# EAGLE design ftdi_breakout (EAGLE 6.4)
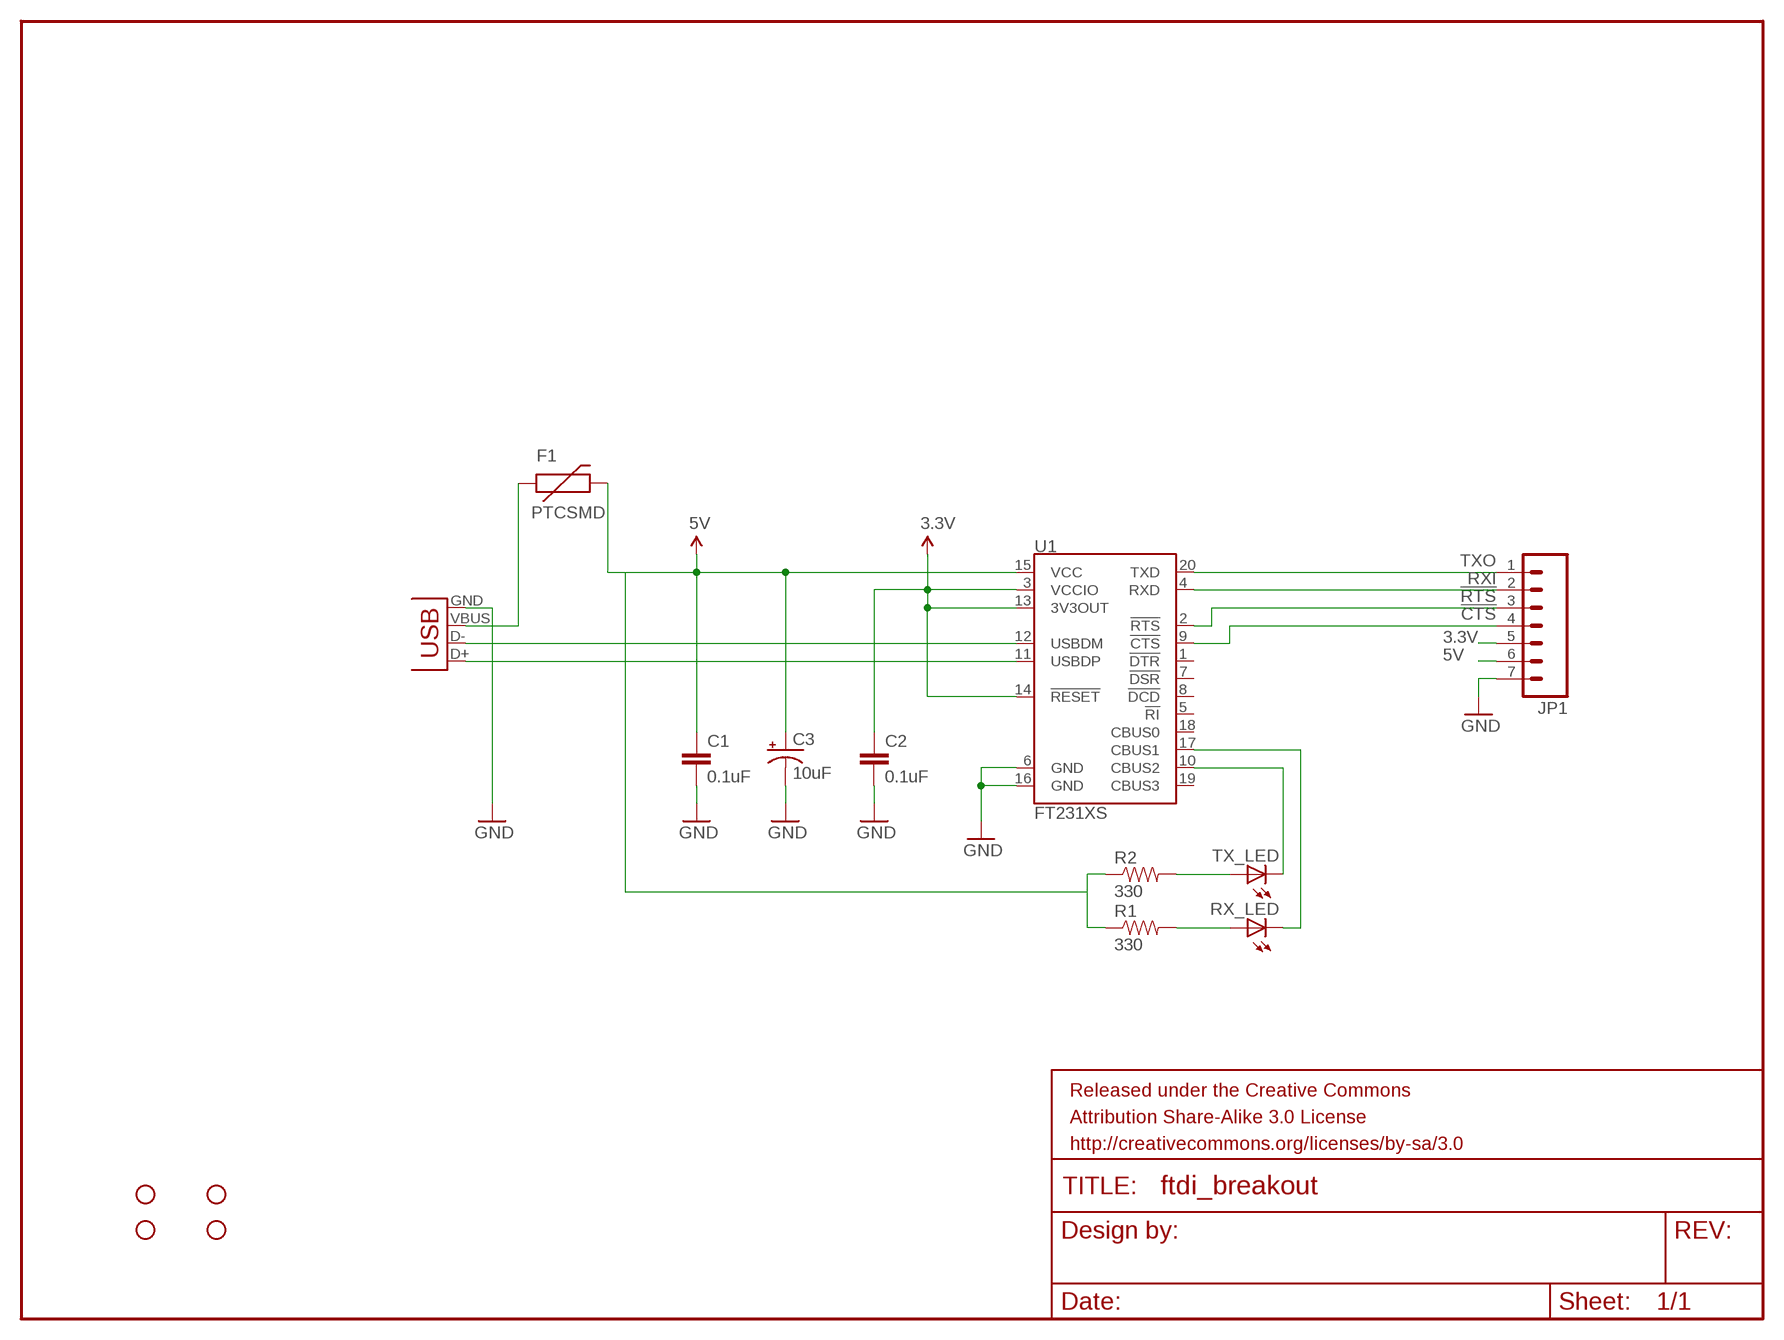
[diagram p0: schematic, sheet 1]

## Parts
C1  0.1uF  CAP0603-CAP  [0603-CAP]
C2  0.1uF  CAP0603-CAP  [0603-CAP]
C3  10uF  CAP_POL1206  [EIA3216]
F1  PTCSMD  [PTC-1206]
FRAME1  FRAME-LETTER  [CREATIVE_COMMONS]
JP1  M07  [1X07]
JP3  USBSMD  [USB-MINIB]
R1  330  RESISTOR0603-RES  [0603-RES]
R2  330  RESISTOR0603-RES  [0603-RES]
RX_LED  LED0603  [LED-0603]
STANDOFF1  STAND-OFF  [STAND-OFF]
STANDOFF2  STAND-OFF  [STAND-OFF]
STANDOFF3  STAND-OFF  [STAND-OFF]
STANDOFF4  STAND-OFF  [STAND-OFF]
TX_LED  LED0603  [LED-0603]
U1  FT231XS  [SSOP20_L]

## Nets
3.3V: C2.1 JP1.5 U1.3(VCCIO) U1.13(3V3OUT) U1.14(!RESET)
5V: C1.1 C3.A(+) F1.2 JP1.6 R1.1 R2.1 U1.15(VCC)
!CTS: JP1.4 U1.9(!CTS)
!RTS: JP1.3 U1.2(!RTS)
GND: C1.2 C2.2 C3.C(-) JP1.7 JP3.GND U1.6(GND) U1.16(GND)
N$1: JP3.D+ U1.11(USBDP)
N$2: F1.1 JP3.VBUS
N$3: JP3.D- U1.12(USBDM)
N$4: RX_LED.C U1.17(CBUS1)
N$5: TX_LED.C U1.10(CBUS2)
N$6: R2.2 TX_LED.A
N$7: R1.2 RX_LED.A
RXI: JP1.2 U1.4(RXD)
TXO: JP1.1 U1.20(TXD)
Unconnected: U1.1(!DTR) U1.5(!RI) U1.7(!DSR) U1.8(!DCD) U1.18(CBUS0) U1.19(CBUS3)

## Library data of the parts
C1 C2 = SparkFun-Passives:CAP: Capacitor Standard 0603 ceramic capacitor, and 0.1" leaded capacitor.
C3 = SparkFun-Passives:CAP_POL: Capacitor Polarized These are standard SMD and PTH capacitors. Normally 10uF, 47uF, and 100uF in electrolytic and tantalum varieties. Always verify the external diameter of the through hole cap, it varies with capacity, voltage, and manufacturer. The EIA devices should be standard.
F1 = SparkFun-PowerIC:PTC: Resettable Fuse PTC Resettable Fuse. Spark Fun Electronics SKU : COM-08357
FRAME1 = SparkFun-Aesthetics:FRAME-LETTER: Schematic Frame Standard 8.5x11 US Letter frame
JP1 = SparkFun-Connectors:M07: Header 7 Standard 7-pin 0.1" header. Use with straight break away headers (SKU : PRT-00116), right angle break away headers (PRT-00553), swiss pins (PRT-00743), machine pins (PRT-00117), and female headers (PRT-00115). NOTES ON THE VARIANTS LOCK and LOCK_LONGPADS... This footprint was designed to help hold the alignment of a through-hole component (i.e. 7-pin header) while soldering it into place. You may notice that each hole has been shifted either up or down by 0.005 of an inch from it's more standard position (which is usually a perfectly straight line). This slight alteration caused the pins (the squares in the middle) to touch the edges of the holes. Because they are alternating, it causes a "brace" to hold the header in place. 0.005 has proven to be the perfect amount of "off-center" position when using our standard breakaway headers. Although looks a little odd when you look at the bare footprint, once you have a header in there, the alteration is very hard to notice. Also, if you push a header all the way into place, it is covered up entirely on the bottom side. This idea of altering the position of holes to aid alignment will be further integrated into the Sparkfun Library for other footprints. It can help hold any component with 3 or more connection pins.
JP3 = SparkFun-Connectors:USB: USB Connectors USB-B-PTH is fully proven SKU : PRT-00139/CONN-08278 USB-miniB is fully proven SKU : PRT-00587 USB-A-PCB is untested. USB-A-H is throughly reviewed, but untested. Spark Fun Electronics SKU : PRT-00437 USB-B-SMT is throughly reviewed, but untested. Needs silkscreen touching up. USB-A-S has not been used/tested USB-MB-H has not been used/tested USB-MICROB has been used. CONN-09505
R1 R2 = SparkFun-Passives:RESISTOR: Resistor Basic schematic elements and footprints for 0603, 1206, and PTH resistors.
RX_LED TX_LED = SparkFun-LED:LED: LEDs Standard schematic elements and footprints for 5mm, 3mm, 1206, and 0603 sized LEDs. 5mm - Spark Fun Electronics SKU : COM-00529 (and others)
STANDOFF1-STANDOFF4 = SparkFun-Electromechanical:STAND-OFF: #4 Stand Off This is the mechanical footprint for a #4 phillips button head screw. Use the keepout ring to avoid running the screw head into surrounding components. SKU : PRT-00447
U1 = SparkFun-DigitalIC:FT231X: FTDI FT231X Full Speed USB to Full-handshake UART This USB2.0 Full Speed IC offers a compact bridge to full handshake UART interfaces. The device is a UART, capable of operating up to 3MBaud, with low power consumption (8mA). The FT231X includes the complete FT-X series feature set and enables USB to be added into a system design quickly and easily over a UART interface.

## Board
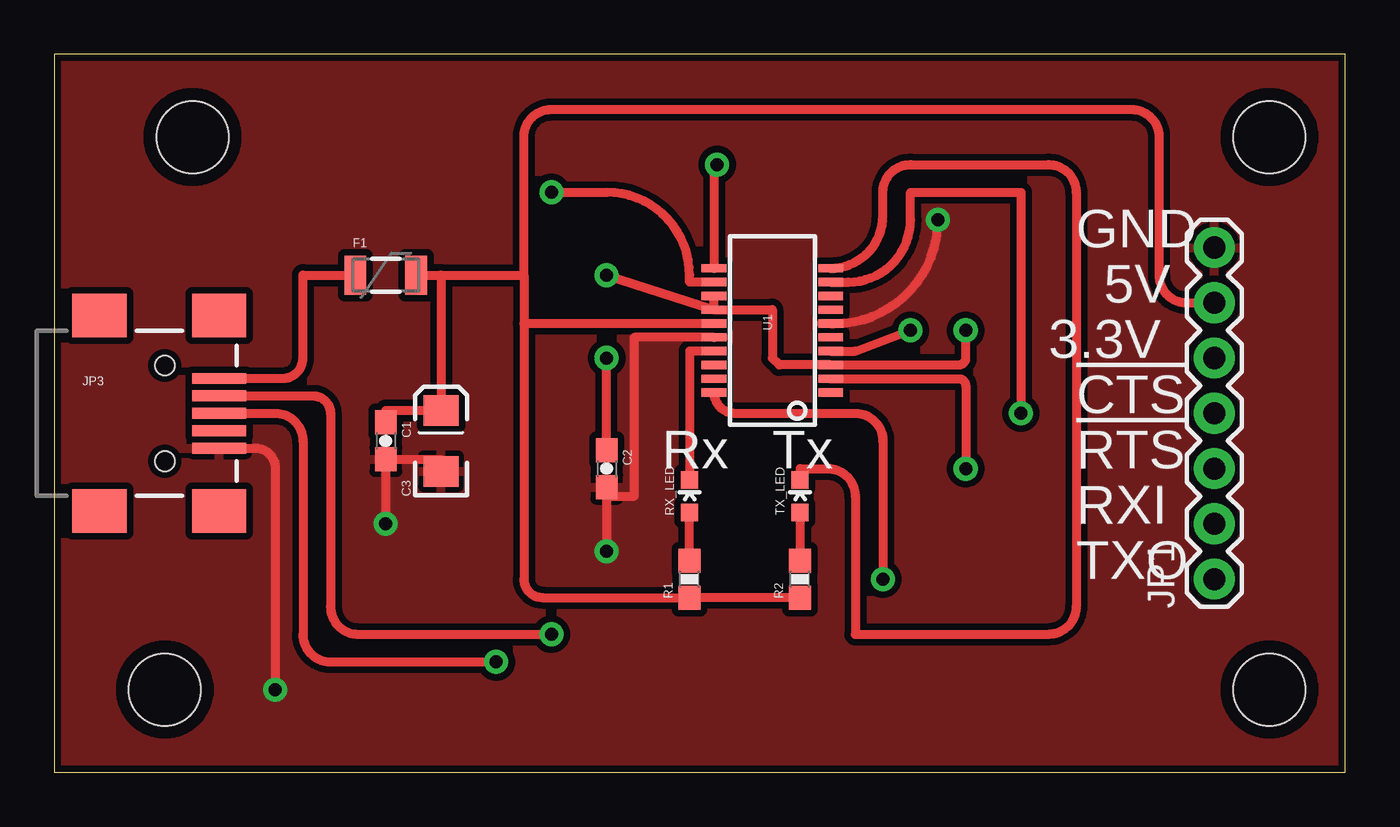
[diagram p1: board, top side]
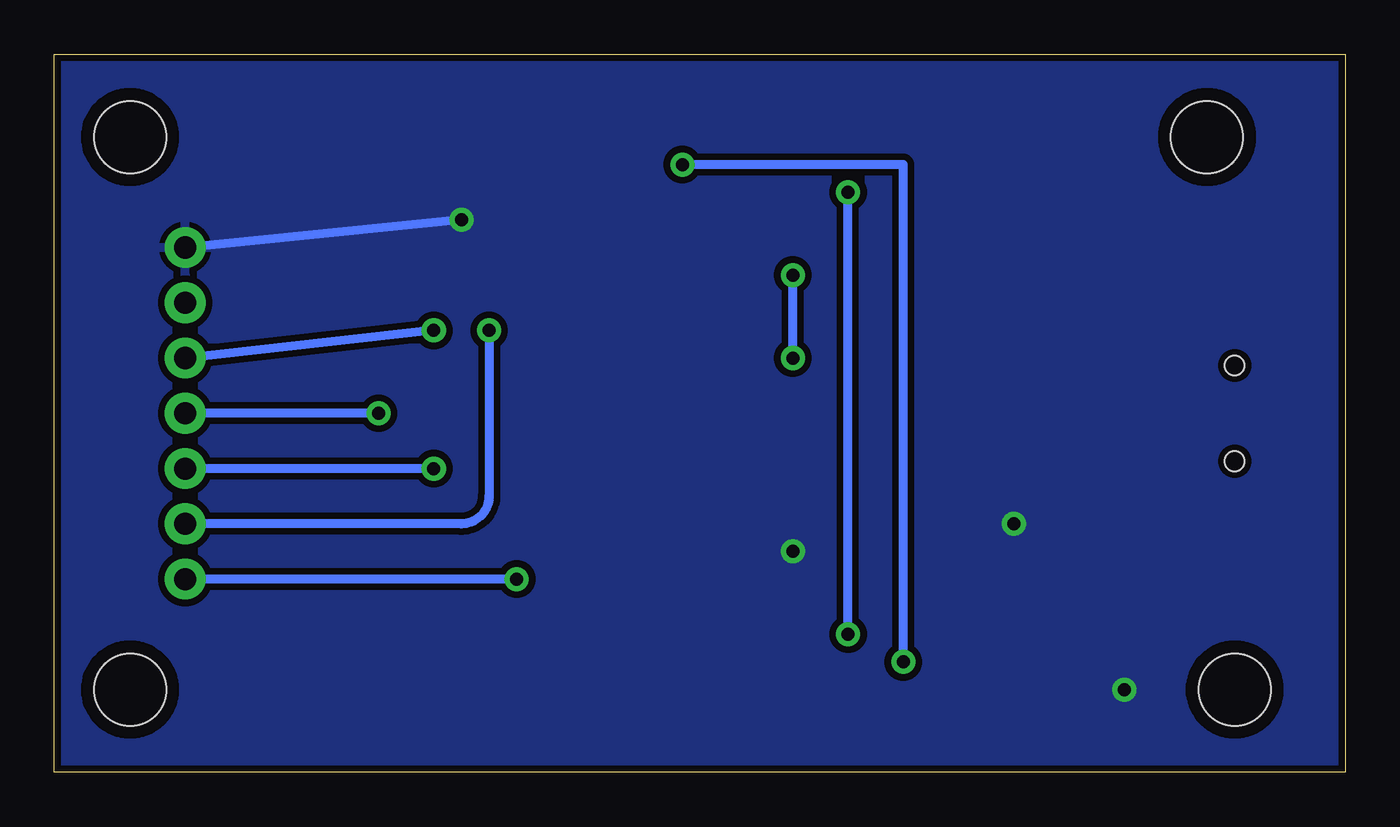
[diagram p2: board, bottom side, seen from below]

Size 59.36 x 33.01 mm. Coordinates in mm from the lower left corner, seen from the top.
Outline: 0,0 59.36,0 59.36,33.01 0,33.01 0,0
Copper layers (1*16): Top 0.035mm / dielectric 1.5mm / Bottom 0.035mm
Design rules "SparkFun-2-layer": minimum track width 7mil, minimum drill 15mil, track to track 8mil, track to pad 8mil, pad to pad 8mil, via to via 8mil, smd to smd 8mil, copper to edge 8mil, drill to drill 8mil, minimum pad ring 12mil, minimum via ring 10mil, stop-mask expansion 4mil, vias tented up to drill 20mil, thermal gap 10mil

### Footprints (pad centres in the part's own frame; a part is rotated, then mirrored left to right if it is on the bottom)
0603-CAP = smd 1.1 x 1: 1 -0.85,0; 2 0.85,0
EIA3216 = smd 1.4 x 1.6: A 1.4,0; C -1.4,0
PTC-1206 = smd 1 x 1.8: 1 -1.4,0; 2 1.4,0
1X07 = drill 1.016 pad 1.88: 1 0,0; 2 2.54,0; 3 5.08,0; 4 7.62,0; 5 10.16,0; 6 12.7,0; 7 15.24,0
USB-MINIB = smd 2.5 x 0.5: D+ 2.5,0; D- 2.5,0.8; GND 2.5,-1.6; ID 2.5,-0.8; VBUS 2.5,1.6 | smd 2.5 x 2: MTN1 -3,4.5; MTN2 2.5,4.5; MTN3 -3,-4.5; MTN4 2.5,-4.5 | hole 0.9: 0,2.2; 0,-2.2
0603-RES = smd 1.1 x 1: 1 -0.85,0; 2 0.85,0
LED-0603 = smd 0.8 x 0.8: A 0,-0.75; C 0,0.75
STAND-OFF = hole 3.302: 0,0
SSOP20_L = smd 0.381 x 1.143: 1 -2.857,-2.68; 2 -2.223,-2.68; 3 -1.587,-2.68; 4 -0.953,-2.68; 5 -0.318,-2.68; 6 0.318,-2.68; 7 0.953,-2.68; 8 1.587,-2.68; 9 2.223,-2.68; 10 2.857,-2.68; 11 2.857,2.68; 12 2.223,2.68; 13 1.587,2.68; 14 0.953,2.68; 15 0.318,2.68; 16 -0.318,2.68; 17 -0.953,2.68; 18 -1.587,2.68; 19 -2.223,2.68; 20 -2.857,2.68

### Placement (x,y rotation side)
C1  15.24,15.24 270 top
C2  25.4,13.97 270 top
C3  17.78,15.24 90 top
F1  15.24,22.86 0 top
FRAME1  3.81,-16.51 0 top  (outside the outline)
JP1  53.34,8.89 90 top
JP3  5.08,16.51 0 top
R1  29.21,8.89 90 top
R2  34.29,8.89 90 top
RX_LED  29.21,12.7 0 top
STANDOFF1  6.35,29.21 0 top
STANDOFF2  5.08,3.81 0 top
STANDOFF3  55.88,29.21 0 top
STANDOFF4  55.88,3.81 0 top
TX_LED  34.29,12.7 0 top
U1  33.02,20.32 90 top

### Tracks (layer width: path | path; a pad name or v marks a point on that pad's centre or on a via)
3.3V  (via drill 0.6)
  Top 0.406: U1.14 33.02,21.27 33.02,19.05 33.34,18.73 U1.3 41.59,18.73 arc90 41.91,19.05 v41.91,20.32 | C2.1 v25.4,19.05 | v25.4,22.86 U1.14 | U1.14 U1.13
  Bottom 0.406: v41.91,20.32 JP1.5 | v25.4,19.05 v25.4,22.86
5V
  Top 0.406: F1.2 17.78,22.86 | 17.78,22.86 21.59,22.86 | 21.59,22.86 21.59,20.64 | C1.1 15.24,16.64 C3.A 17.78,22.86 | R2.1 R1.1 22.44,8.04 arc-90 21.59,8.89 21.59,20.64 | U1.15 21.59,20.64 | 21.59,22.86 21.59,29.21 arc-90 22.86,30.48 49.53,30.48 arc-90 50.8,29.21 50.8,22.86 arc90 52.07,21.59 JP1.6
!CTS  (via drill 0.6)
  Top 0.406: U1.9 36.51,22.54 arc90 39.37,25.4 39.37,26.67 44.45,26.67 v44.45,16.51
  Bottom 0.406: v44.45,16.51 JP1.4
!RTS  (via drill 0.6)
  Top 0.406: U1.2 41.59,18.1 arc-90 41.91,17.78 v41.91,13.97
  Bottom 0.406: v41.91,13.97 JP1.3
GND  (via drill 0.6)
  Top 0.406: 25.4,12.7 v25.4,10.16 | JP3.GND 9.22,14.91 arc-90 10.16,13.97 v10.16,3.81 | C3.C 17.78,14.39 C1.2 v15.24,11.43 | U1.16 26.67,20 26.67,12.7 25.4,12.7 | 25.4,12.7 C2.2 | U1.6 35.88,20.64 arc90 v40.64,25.4
  Bottom 0.406: v40.64,25.4 JP1.7
  pour Top (isolate 0.305): 59.69,0 0,0 0,33.02 59.69,33.02
  pour Bottom (isolate 0.305): 59.69,0 0,0 0,33.02 59.69,33.02 59.69,31.75
N$1  (via drill 0.6)
  Top 0.406: v30.48,27.94 30.34,27.94 U1.11 | JP3.D+ 10.16,16.51 arc-90 11.43,15.24 11.43,6.35 arc90 12.7,5.08 v20.32,5.08
  Bottom 0.406: v20.32,5.08 20.32,27.94 v30.48,27.94
N$2
  Top 0.406: JP3.VBUS 10.49,18.11 arc90 11.43,19.05 11.43,22.86 F1.1
N$3  (via drill 0.6)
  Top 0.406: U1.12 29.21,22.54 29.21,22.86 arc90 25.4,26.67 v22.86,26.67 | JP3.D- 11.9,17.31 arc-90 12.7,16.51 12.7,7.62 arc90 13.97,6.35 v22.86,6.35
  Bottom 0.406: v22.86,6.35 v22.86,26.67
N$4
  Top 0.406: U1.17 29.21,19.37 RX_LED.C
N$5
  Top 0.406: U1.10 arc90 38.1,25.58 38.1,26.67 arc-90 39.37,27.94 45.72,27.94 arc-90 46.99,26.67 46.99,7.62 arc-90 45.72,6.35 36.83,6.35 36.83,12.7 arc90 35.56,13.97 34.29,13.97 TX_LED.C
N$6
  Top 0.406: TX_LED.A R2.2
N$7
  Top 0.406: R1.2 RX_LED.A
RXI  (via drill 0.6)
  Top 0.406: v39.37,20.32 36.83,19.37 U1.4
  Bottom 0.406: v39.37,20.32 39.37,12.7 arc90 40.64,11.43 JP1.2
TXO  (via drill 0.6)
  Top 0.406: U1.20 arc90 31.29,16.51 36.83,16.51 arc-90 38.1,15.24 v38.1,8.89
  Bottom 0.406: v38.1,8.89 JP1.1

### Text on the board
tPlace: GND | 5V | 3.3V | !CTS | Rx | Tx | !RTS | RXI | TXO